# Altium schematic sheet OptocouplerKicker.SchDoc
size A; SheetNumber: 3; SheetTotal: 4
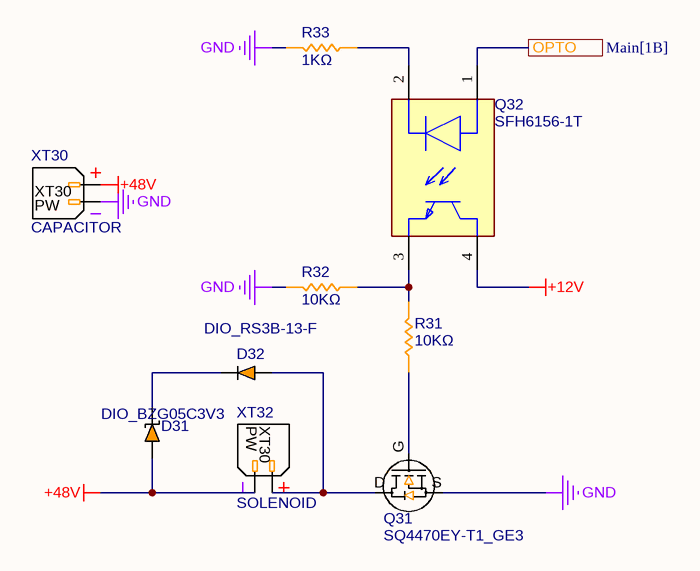
[diagram p0: OptocouplerKicker.SchDoc]

## Parts
D31  DIO_BZG05C3V3  [DIO_BZG05C3V3]
D32  DIO_RS3B-13-F  [DIO_RS3B-13-F]
Q31  SQ4470EY-T1_GE3  [SQ4470EY-T1_GE3]
Q32  SFH6156-1T  [FP-83911-MFG]
R31  10KΩ  [RES_0603]
R32  10KΩ  [RES_0603]
R33  1KΩ  [RES_0603]
XT30  CAPACITOR  [XT30_PW_M]
XT32  SOLENOID  [XT30_PW_M]

## Ports
OPTO (see Main[1B])

## Nets
+12V: Q32.4(C)
+48V: D31.A XT30.P XT32.N
GND: Q31.S R32.1 R33.1 XT30.N
OPTO: Q32.1(A) ; port OPTO
NetD31_C: D31.C D32.C
NetD32_A: D32.A Q31.D XT32.P
NetQ31_G: Q31.G R31.2
NetQ32_2: Q32.2(C) R33.2
NetQ32_3: Q32.3(E) R31.1 R32.2

## Notes on the sheet
- (in symbol XT30_PW_M) PW; XT30

## Library data of the parts
Q32 = CMP-00030-03895371-1: SFH6156-1T Optocoupler Dc-in 1-CH Transistor Dc-out 4-PIN PDIP SMD T/r; Fall Time: 11s; Number of Elements: 1; Output Voltage: 70V; Forward Current: 60mA; Forward Voltage: 1.25V; Turn-On Delay Time: 3µs; Power Dissipation: 150mW; Isolation Voltage: 5.3kV; Collector Emitter Saturation Voltage: 400mV; Output Current per Channel: 50mA; Reverse Breakdown Voltage: 6V; Max Collector Current: 100mA; Current Transfer Ratio: 80%; Rise Time: 2s; Turn-Off Delay Time: 2.3µs; Mount: PCB, Surface Mount; NexarPartId: 3895371; Ambient Temperature Range High: 100°C; Number of Channels: 1; Number of Pins: 4; RoHS: Compliant; Max Output Voltage: 70V; Case/Package: SMD/SMT; Radiation Hardening: No; Max Input Current: 60mA; Height: 4.059mm; Max Power Dissipation: 150mW; Packaging: Digi-Reel®; Max Operating Temperature: 100°C; Schedule B: 8541408000, 8541408000; Reverse Voltage: 6V; Lead Free: Lead Free; Min Operating Temperature: -55°C; Collector Emitter Voltage (VCEO): 70V; Input Current: 60mA
R31-R33 = RES_0603: Resistor SMD 0603 generic
XT30 XT32 = XT30_PW_M